# Altium schematic sheet 12 BOOT.SchDoc
size 513 x 386 mm
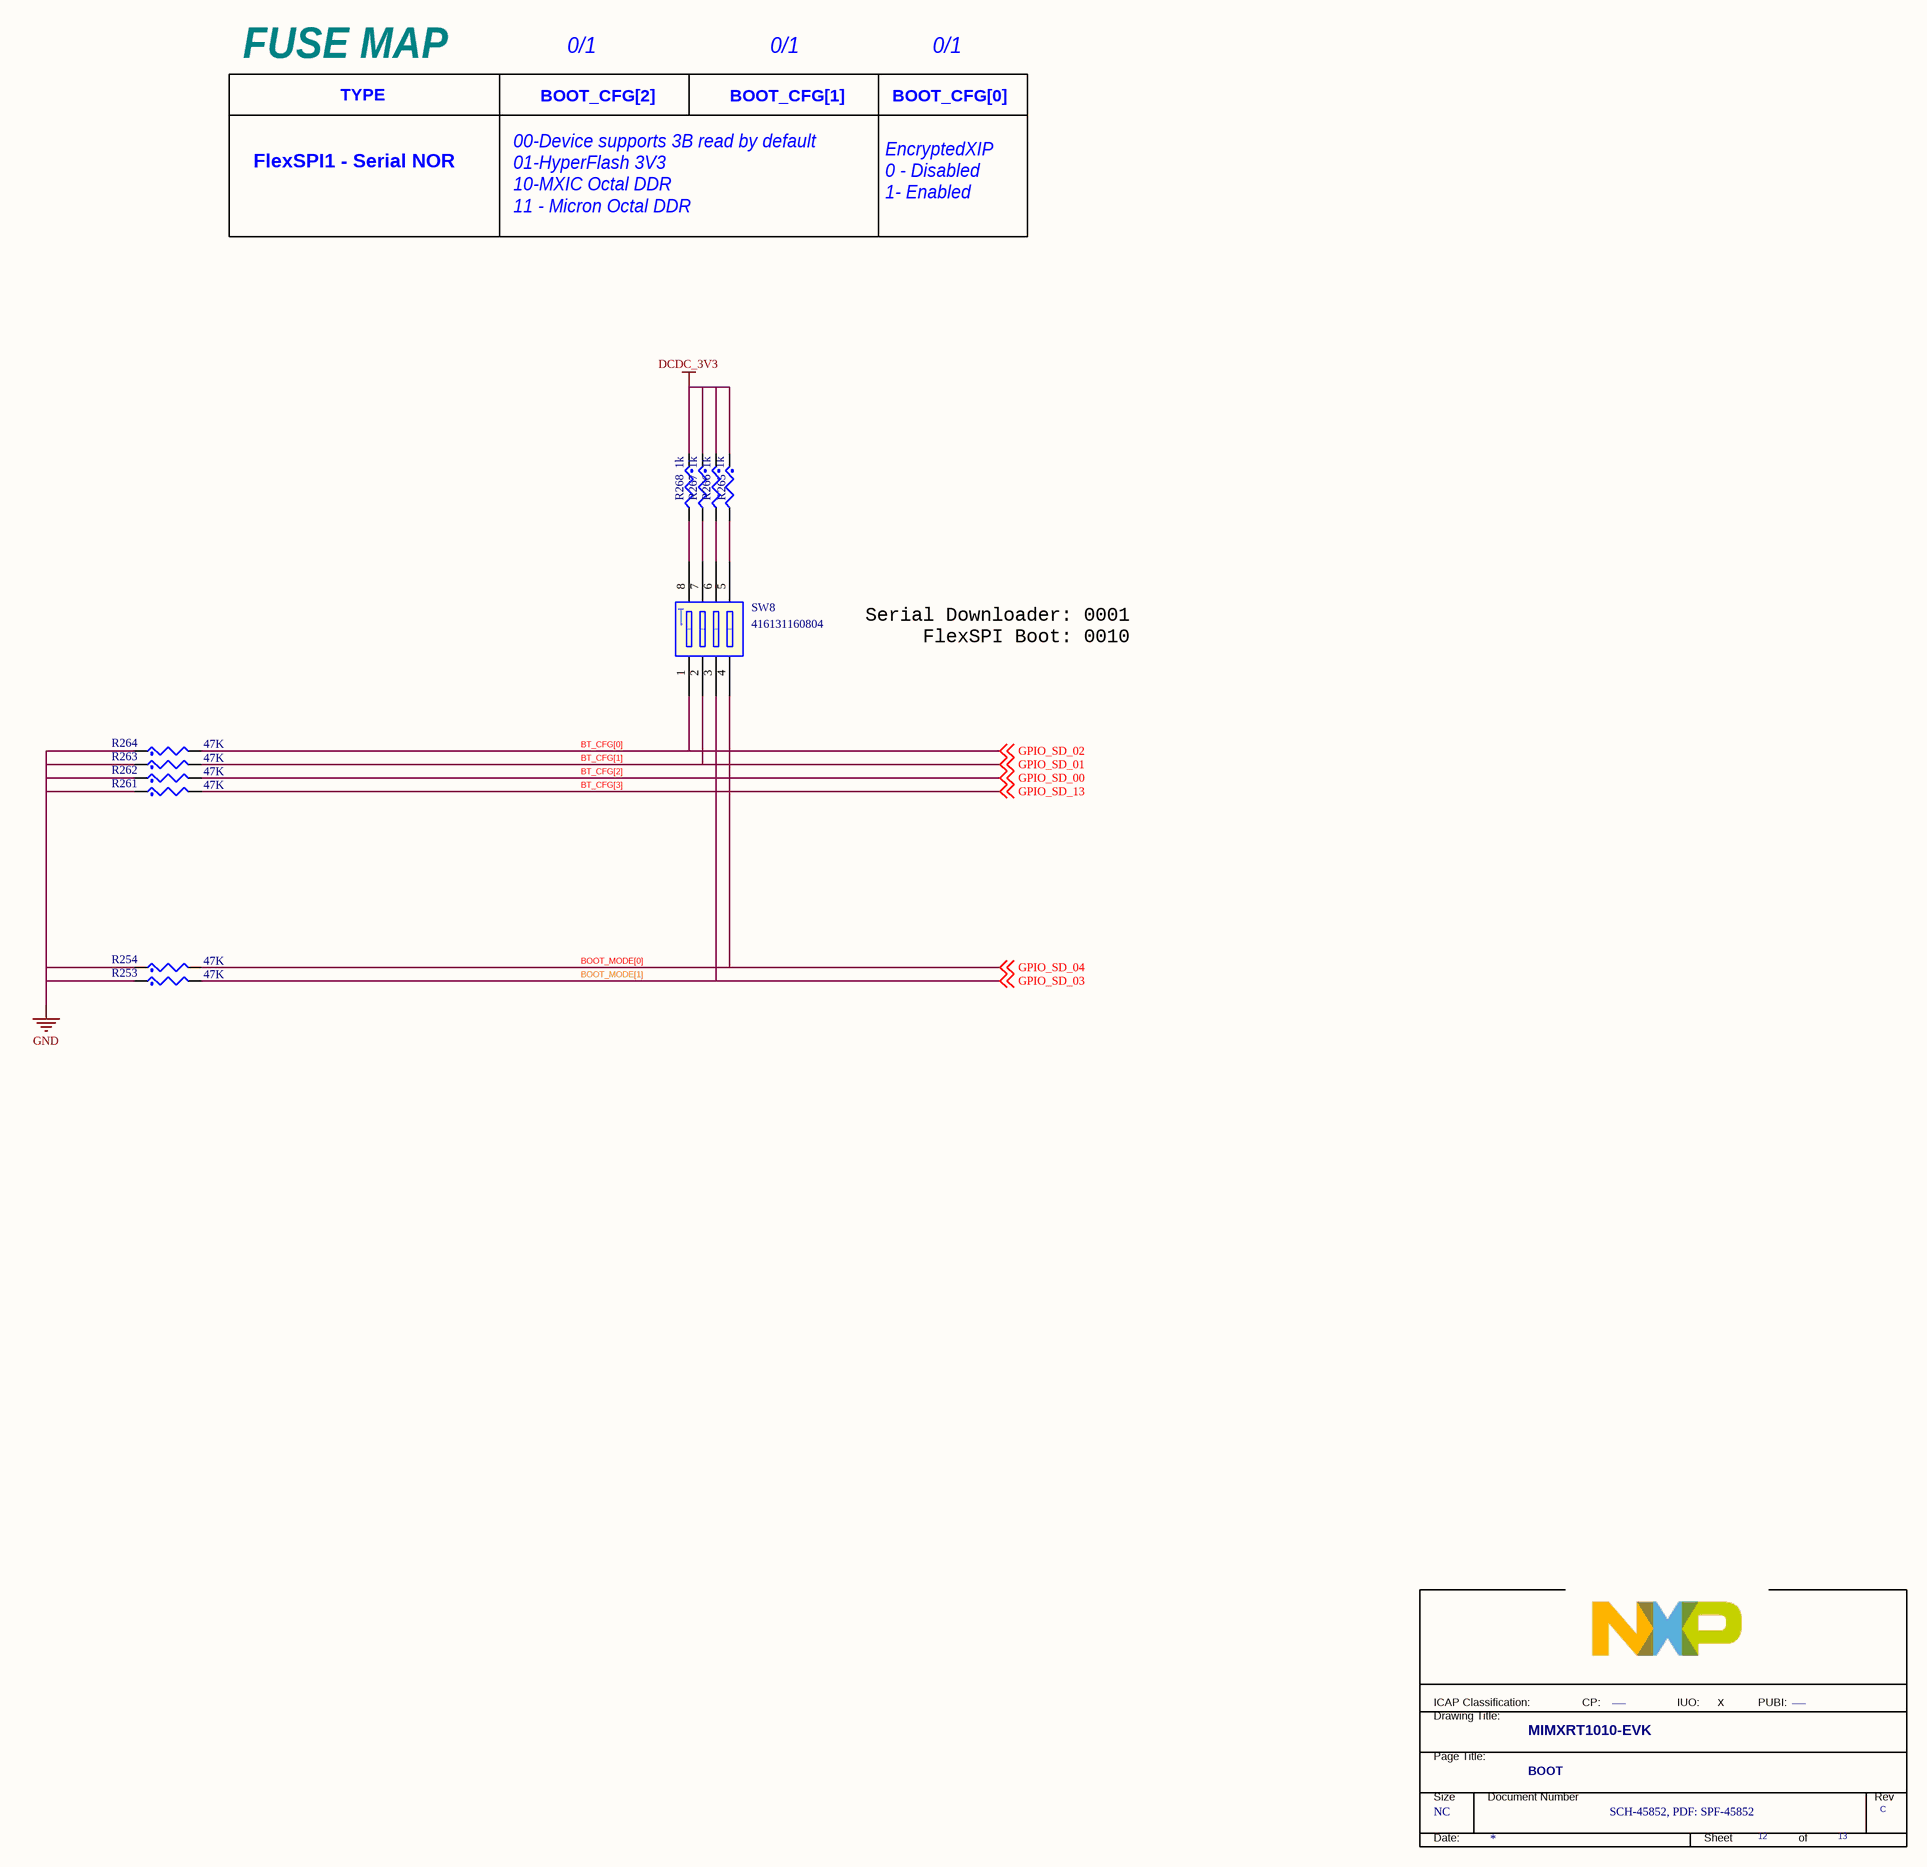
[diagram p0: 12 BOOT.SchDoc]

## Parts
*  PUBI: ___  Doc: SCH-45852, PDF: SPF-45852  RevCode: C  Title: MIMXRT1010-EVK  Page Size: NC  Page Number: 12  Page Count: 13  PageTitle: BOOT  (hidden comment: TitleBlock_FS)  (graphical)
R253  47K  [RC0402_25]
R254  47K  [RC0402_25]
R261  47K  [RC0402_25]
R262  47K  [RC0402_25]
R263  47K  [RC0402_25]
R264  47K  [RC0402_25]
R265  1k  [RC0402_25]
R266  1k  [RC0402_25]
R267  1k  [RC0402_25]
R268  1k  [RC0402_25]
SW8  416131160804  [sw4_dip_1p27_6p3x5p7]

## Nets
DCDC_3V3: R265.1 R266.1 R267.1 R268.1
GND: R253.1 R254.1 R261.1 R262.1 R263.1 R264.1
BOOT_MODE[0]: R254.2 SW8.4(A4) ; off-sheet GPIO_SD_04  [also labelled GPIO_SD_04]
BOOT_MODE[1]: R253.2 SW8.3(A3) ; off-sheet GPIO_SD_03  [also labelled GPIO_SD_03]
BT_CFG[0]: R264.2 SW8.1(A1) ; off-sheet GPIO_SD_02  [also labelled GPIO_SD_02]
BT_CFG[1]: R263.2 SW8.2(A2) ; off-sheet GPIO_SD_01  [also labelled GPIO_SD_01]
BT_CFG[2]: R262.2 ; off-sheet GPIO_SD_00  [also labelled GPIO_SD_00]
BT_CFG[3]: R261.2 ; off-sheet GPIO_SD_13  [also labelled GPIO_SD_13]
NetR265_2: R265.2 SW8.5(B4)
NetR266_2: R266.2 SW8.6(B3)
NetR267_2: R267.2 SW8.7(B2)
NetR268_2: R268.2 SW8.8(B1)

## Notes on the sheet
- 0/1
- FUSE MAP
- TYPE
- 00-Device supports 3B read by default
  01-HyperFlash 3V3
  10-MXIC Octal DDR
  11 - Micron Octal DDR
- BOOT_CFG[2]
- BOOT_CFG[1]
- BOOT_CFG[0]
- FlexSPI1 - Serial NOR
- EncryptedXIP
  0 - Disabled
  1- Enabled
- Serial Downloader: 0001
  FlexSPI Boot: 0010
- X
- (in symbol TitleBlock_FS) ICAP Classification:; CP:; IUO:; PUBI:; Drawing Title:; Page Title:; Size; Document Number; Rev; Date:; Sheet; of

## Library data of the parts
* = TitleBlock_FS: FIUO: _X_; OrgName: Freescale Semiconductor; OrgAddr1: 6501 William Cannon Drive West; OrgAddr2: Austin, TX 78735-8598; FCP: ___; Page Create Date: March  8, 1995; Page Modify Date: *
R253 R262 R264 = RES_Dup1: RES MF 47K  1/16W 1% 0402; CLASS: DISCRETE; FPLIST: RC0402_25,RC0402_HD,0402_CC; CAD_APPROVED: Yes; Temp_Range: ¨C55 ¡ãC to +155 ¡ãC; MFG_PN01: RC0402FR-0747KL; MFG_NAME01: YAGEO AMERICA; AGILE_PN: 470-31023; PCB Footprint: RC0402_25; HEIGHT: 0.40 MM; ROHS: Yes; Tolerance: 1%
R254 R261 R263 = RES_Dup1: RES MF 47K  1/16W 1% 0402; CLASS: DISCRETE; AGILE_PN: 470-31023; MFG_NAME01: YAGEO AMERICA; MFG_PN01: RC0402FR-0747KL; Temp_Range: ¨C55 ¡ãC to +155 ¡ãC; CAD_APPROVED: Yes; FPLIST: RC0402_25,RC0402_HD,0402_CC; PCB Footprint: RC0402_25; Tolerance: 1%; ROHS: Yes; HEIGHT: 0.40 MM
R265-R267 = RES_Dup1: RES MF 1.0K 1/16W 5% 0402; CLASS: DISCRETE; FPLIST: RC0402_25,RC0402_HD,RC0402_X2,0402_CC; CAD_APPROVED: Yes; MFG_PN01: CRCW04021K00JNED; MFG_NAME01: VISHAY INTERTECHNOLOGY; AGILE_PN: 470-75555; PCB Footprint: RC0402_25; HEIGHT: 0.41mm; ROHS: Yes; Tolerance: 5%
R268 = RES_Dup1: RES MF 1.0K 1/16W 5% 0402; CLASS: DISCRETE; AGILE_PN: 470-75555; MFG_NAME01: VISHAY INTERTECHNOLOGY; MFG_PN01: CRCW04021K00JNED; CAD_APPROVED: Yes; FPLIST: RC0402_25,RC0402_HD,RC0402_X2,0402_CC; PCB Footprint: RC0402_25; Tolerance: 5%; ROHS: Yes; HEIGHT: 0.41mm
SW8 = SW_DIP4: SW DIP 4 POS 0.025A@24VDC SMT; CLASS: IC; AGILE_PN: 510-78047; MFG_NAME01: WURTH ELEKTRONIK EISOS GMBH & CO. KG (ELECTRONIC & ELECTROMEHANICAL COMP); CAD_APPROVED: Yes; PCB Footprint: sw4_dip_1p27_6p3x5p7; MFG_PN01: 416131160804; ROHS: Yes; HEIGHT: 2.1MM